# EAGLE schematic MDAS_Controller_V1_test (EAGLE 9.0.0)
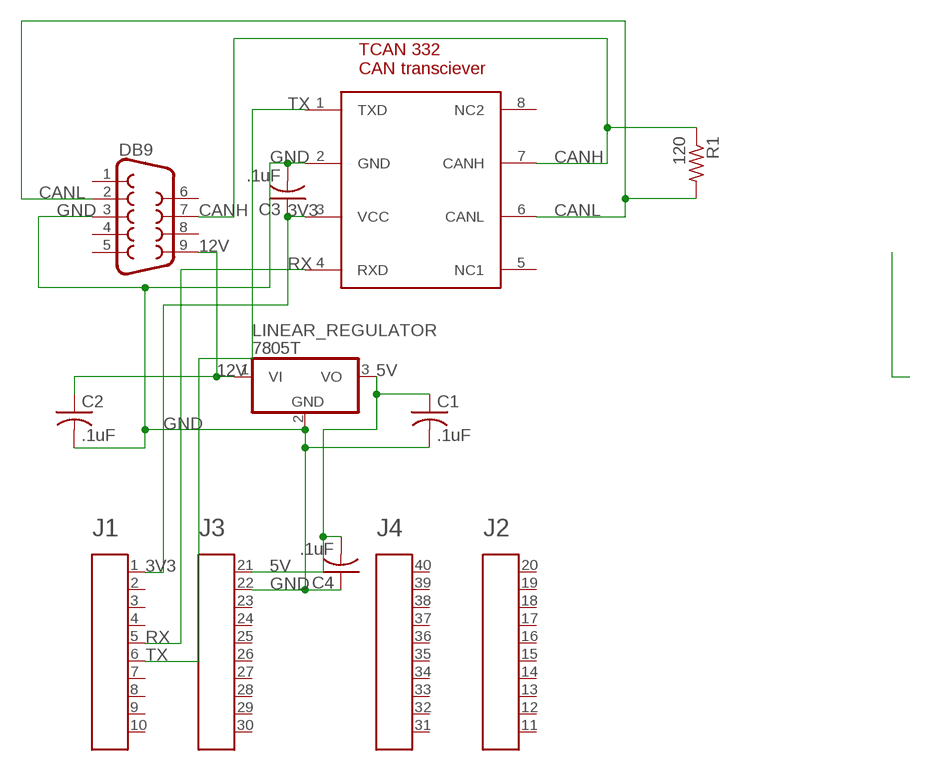
[diagram p0: schematic, sheet 1]

## Parts
A1  HEADER4X10-BOOSTERPACK  [4X10-BOOSTERPACK]
C1  .1uF  C-USC0603  [C0603]
C2  .1uF  C-USC0603  [C0603]
C3  .1uF  C-USC0603  [C0603]
C4  .1uF  C-USC0603  [C0603]
CAN_TRANSCIEVER  TCAN332  [SOIC127P600X172-8N]
DB9  DB9FEMALE  [DB9]
LINEAR_REGULATOR  7805T  [TO220H]
R1  120  R-US_0207/10  [0207/10]

## Nets
3V3: A1.1 C3.1 CAN_TRANSCIEVER.3(VCC)
5V: A1.21 C1.1 C4.2 LINEAR_REGULATOR.3(VO)
12V: C2.1 DB9.9 LINEAR_REGULATOR.1(VI)
CANH: CAN_TRANSCIEVER.7(CANH) DB9.7 R1.1
CANL: CAN_TRANSCIEVER.6(CANL) DB9.2 R1.2
GND: A1.22 C1.2 C2.2 C3.2 C4.1 CAN_TRANSCIEVER.2(GND) DB9.3 LINEAR_REGULATOR.2(GND)
RX: A1.5 CAN_TRANSCIEVER.4(RXD)
TX: A1.6 CAN_TRANSCIEVER.1(TXD)
Unconnected: A1.2 A1.3 A1.4 A1.7 A1.8 A1.9 A1.10 A1.11 A1.12 A1.13 A1.14 A1.15 A1.16 A1.17 A1.18 A1.19 A1.20 A1.23 A1.24 A1.25 A1.26 A1.27 A1.28 A1.29 A1.30 A1.31 A1.32 A1.33 A1.34 A1.35 A1.36 A1.37 A1.38 A1.39 A1.40 CAN_TRANSCIEVER.5(NC1) CAN_TRANSCIEVER.8(NC2) DB9.1 DB9.4 DB9.5 DB9.6 DB9.8

## Library data of the parts
A1 = EAGLE_BoosterPack_Library:HEADER4X10-BOOSTERPACK
C1-C4 = adafruit:C-US: CAPACITOR, American symbol
CAN_TRANSCIEVER = Texas Instruments_By_element14_Batch_1:TCAN332
DB9 = SparkFun-Connectors:DB9: DB9 Connector Standard DB9 (D-Sub 9) serial connector. Can be used for CAN bus as well as RS485 and RS232. Footprint production proven. Here is the female version connector we sell at SparkFun: 9 Pin Female Serial Connector - PCB Mount <https://www.sparkfun.com/products/429> (PRT-00429) This connector has been used on the following SparkFun products: SparkFun RS232 Shifter - SMD <https://www.sparkfun.com/products/449> (PRT-00449) SparkFun RS232 Shifter SMD (No DB9) <https://www.sparkfun.com/products/8780> (PRT-08780); PROD_ID: CONN-08194
LINEAR_REGULATOR = adafruit:78*: Positive VOLTAGE REGULATOR Added bigger pads to the TO-92 package
R1 = adafruit:R-US_: RESISTOR, American symbol